# EAGLE schematic PC_adder (EAGLE 9.4.2)
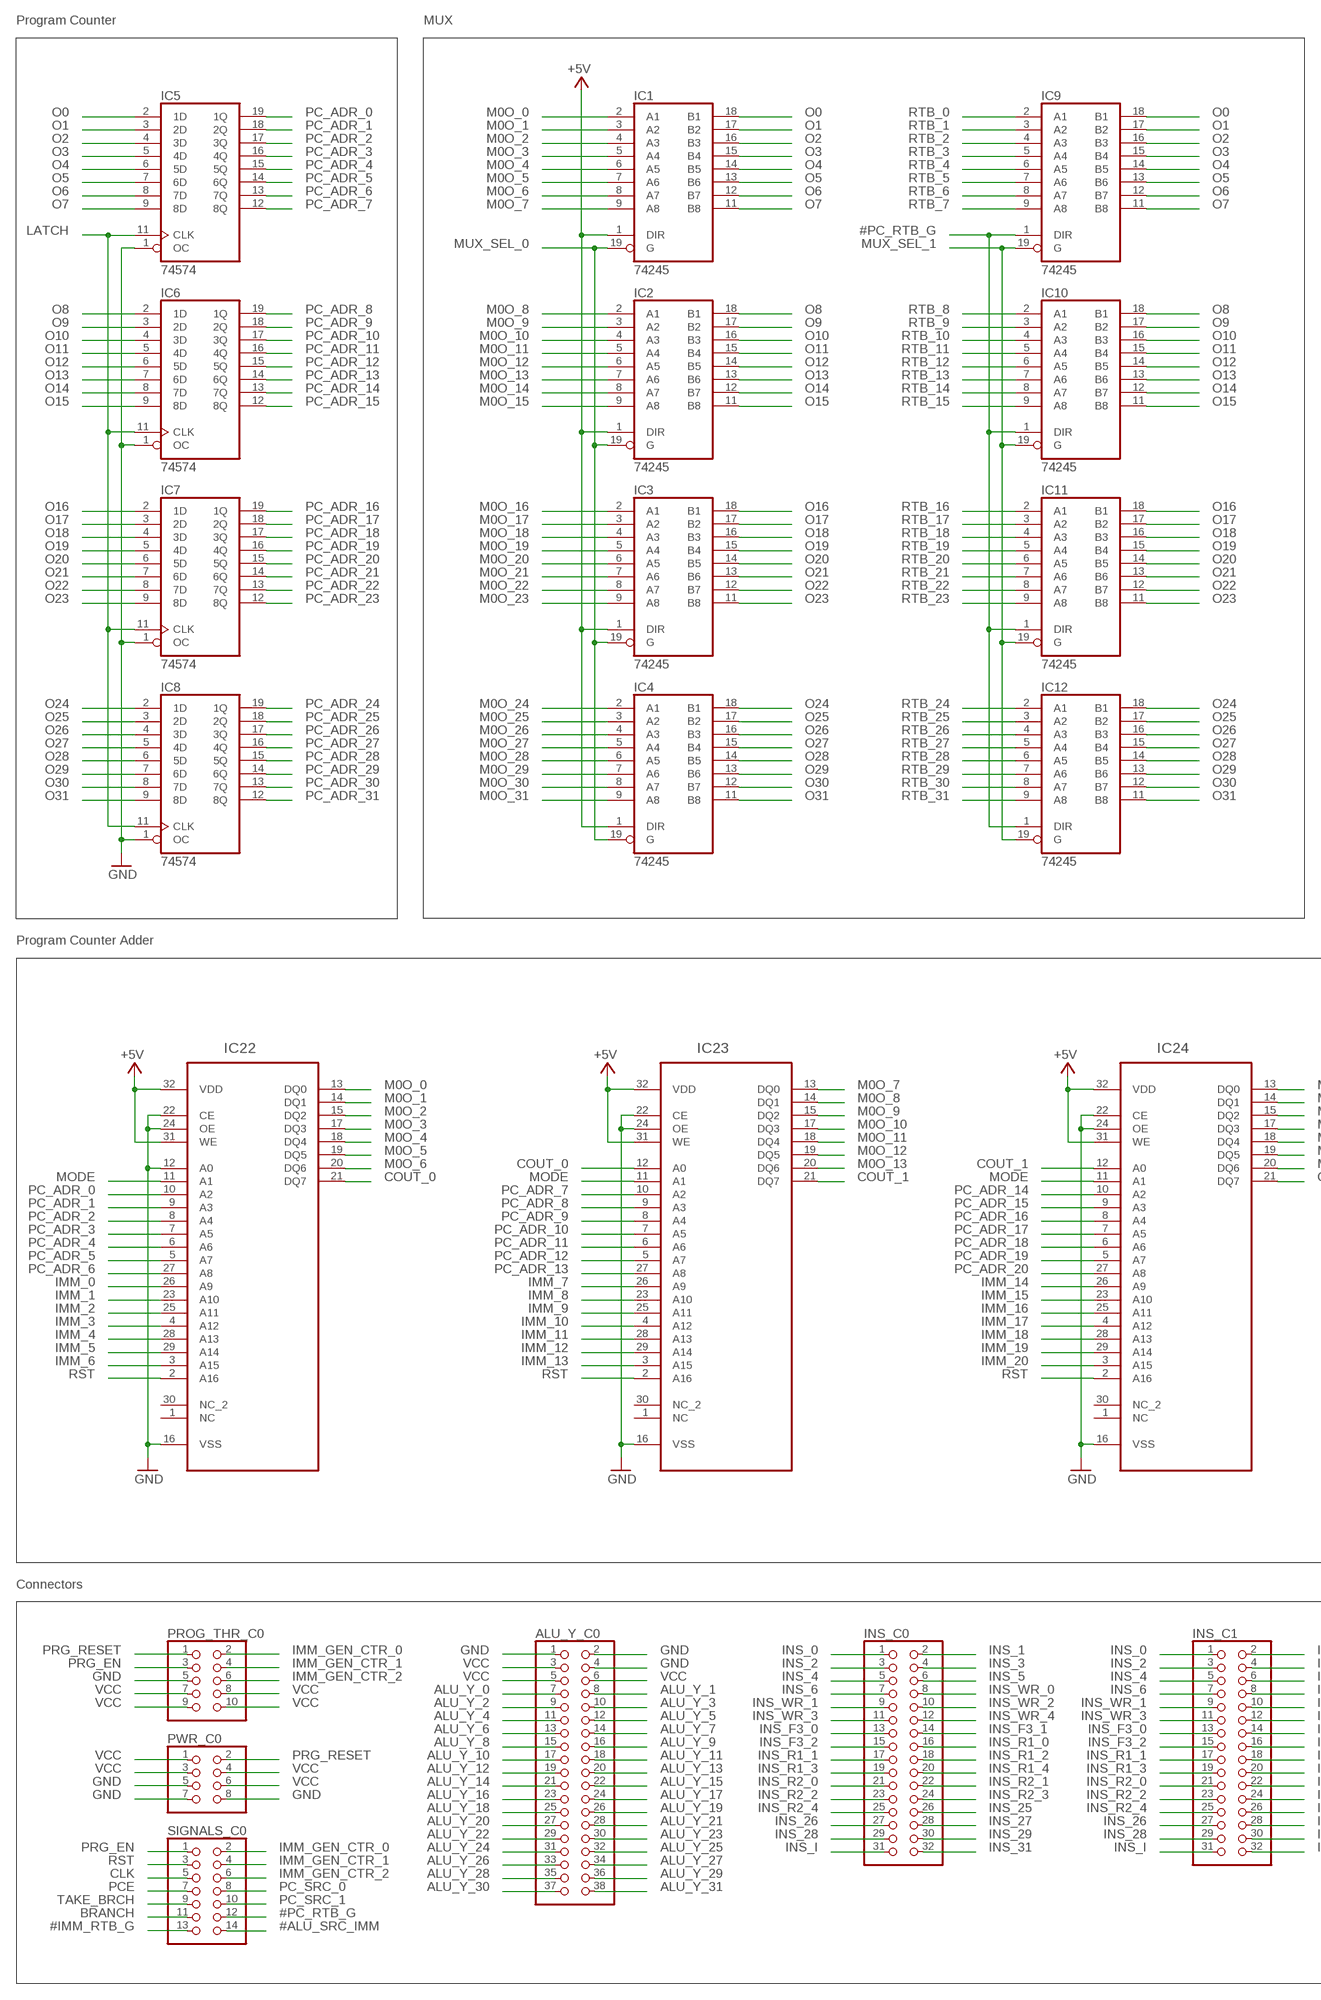
[diagram p0: schematic, sheet 1, part 1 of 2]
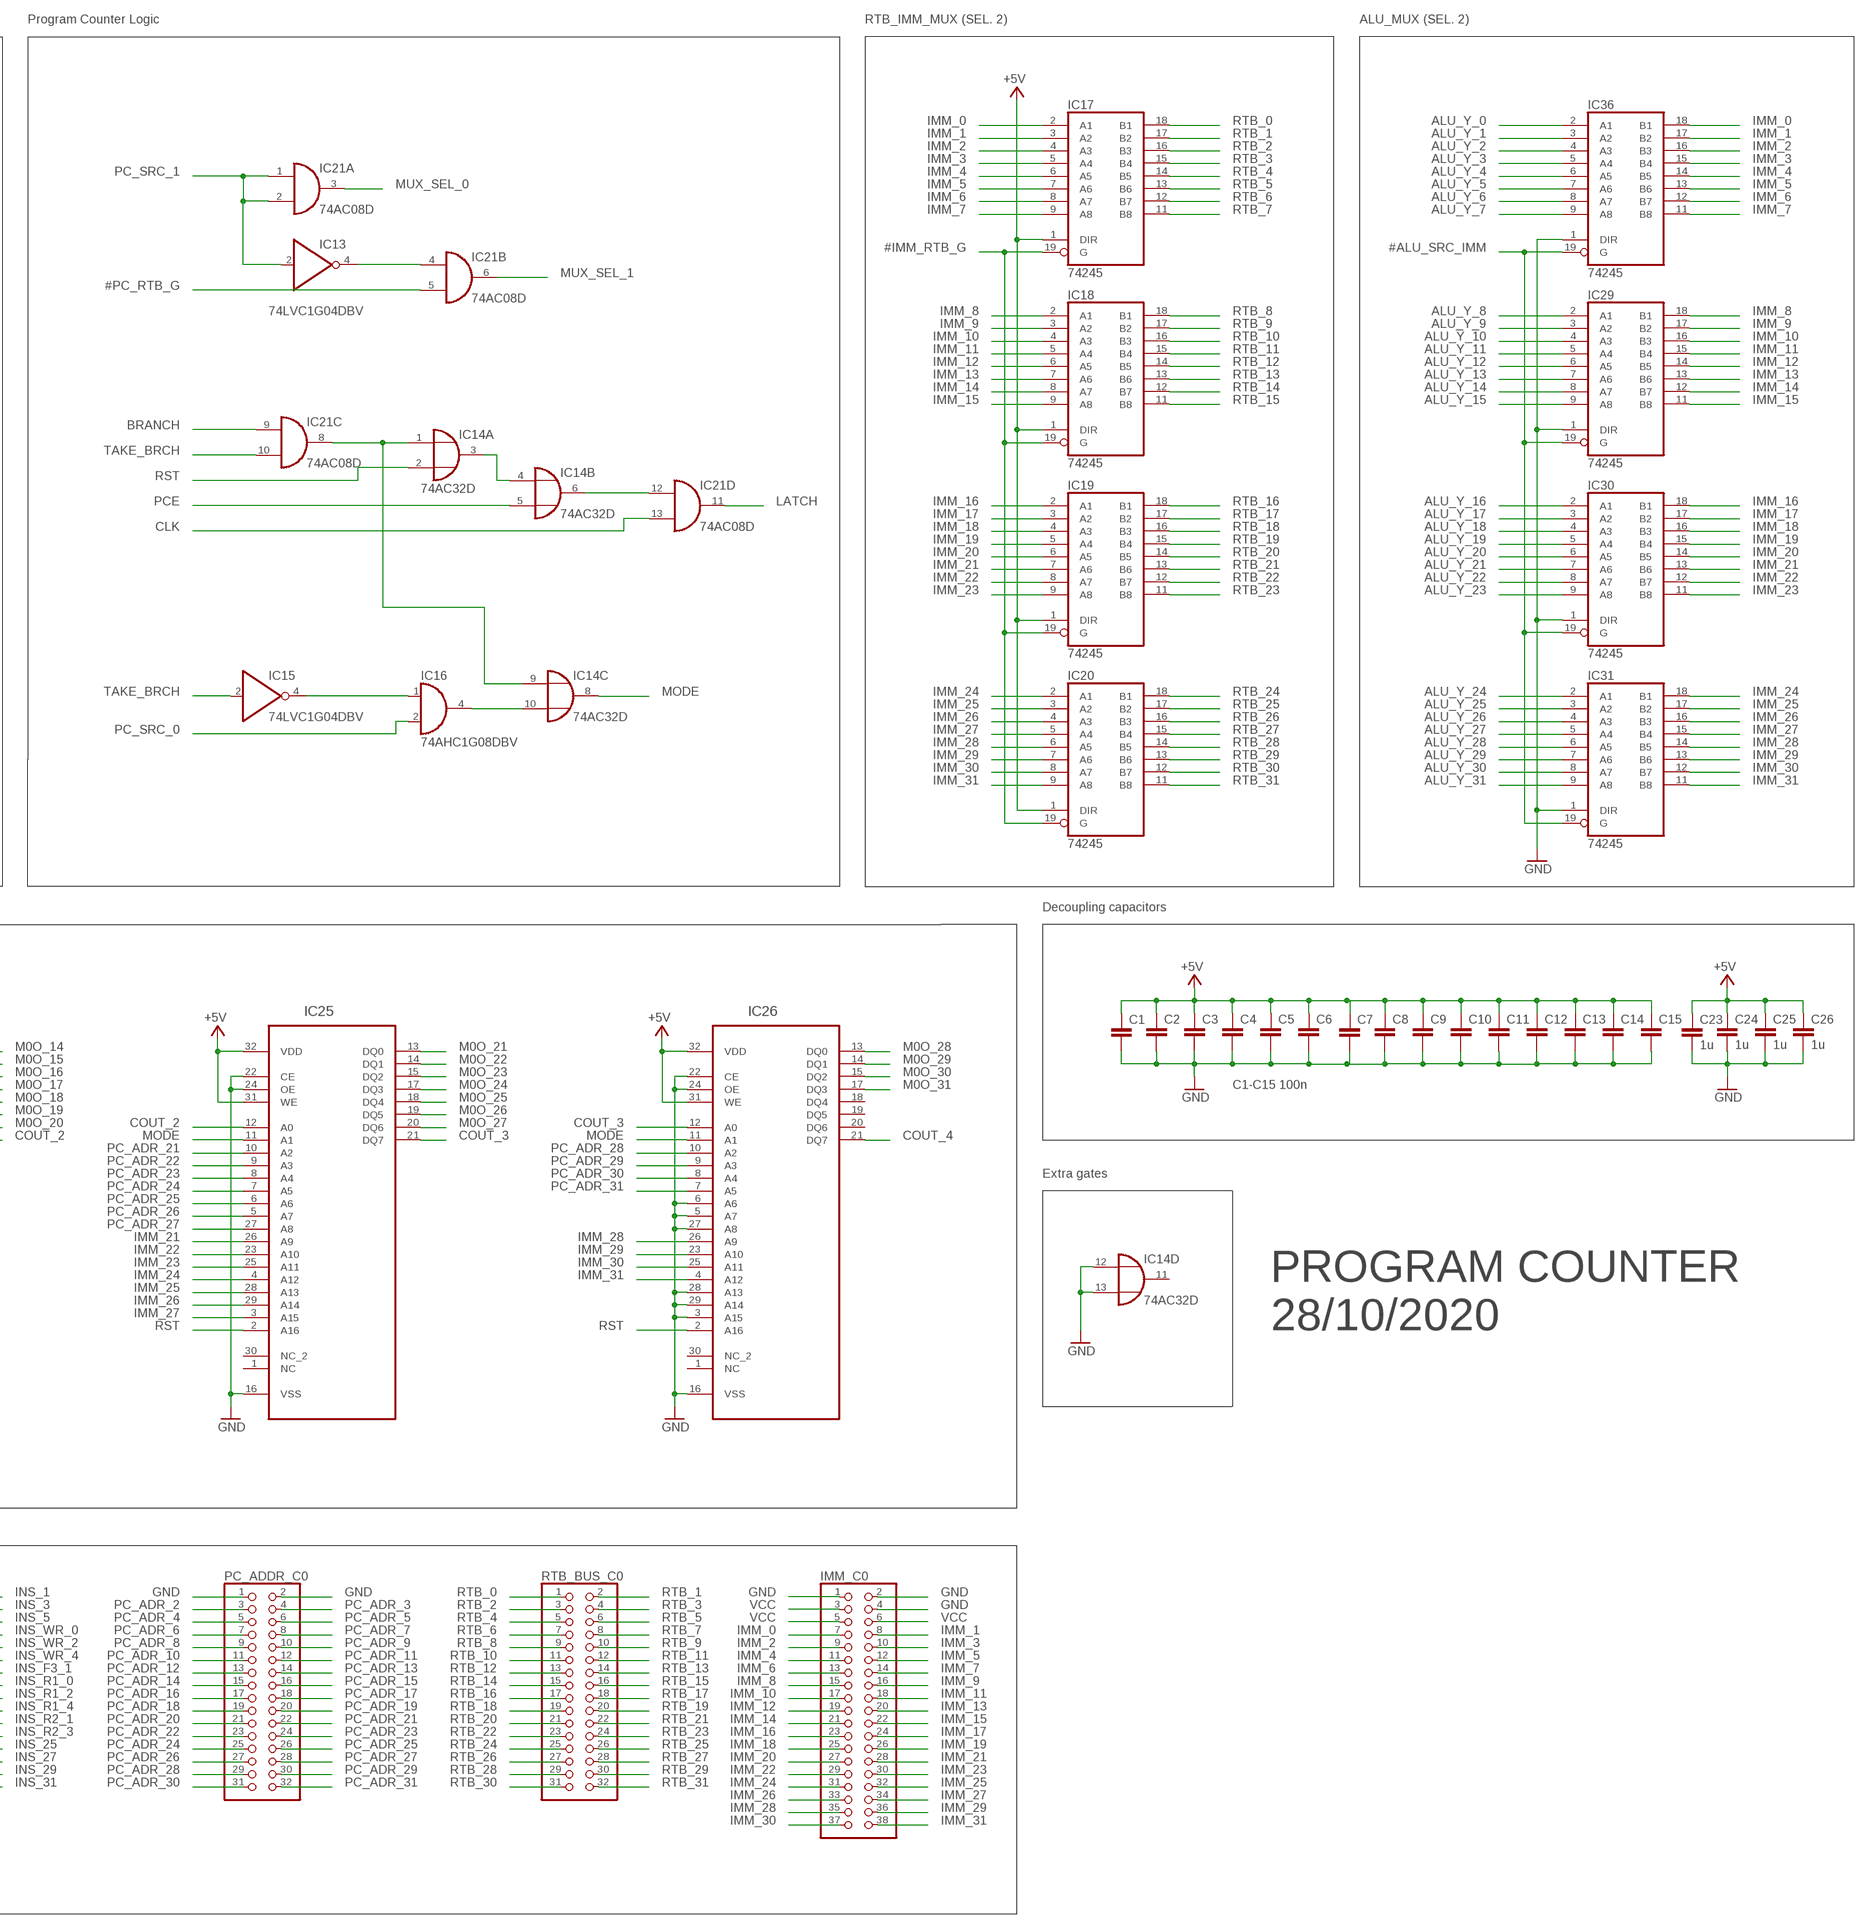
[diagram p1: schematic, sheet 1, part 2 of 2]

## Parts
ALU_Y_C0  PINHD-2X19  [2X19]
C1  C-EUC0805  [C0805]
C2  C-EUC0805  [C0805]
C3  C-EUC0805  [C0805]
C4  C-EUC0805  [C0805]
C5  C-EUC0805  [C0805]
C6  C-EUC0805  [C0805]
C7  C-EUC0805  [C0805]
C8  C-EUC0805  [C0805]
C9  C-EUC0805  [C0805]
C10  C-EUC0805  [C0805]
C11  C-EUC0805  [C0805]
C12  C-EUC0805  [C0805]
C13  C-EUC0805  [C0805]
C14  C-EUC0805  [C0805]
C15  C-EUC0805  [C0805]
C23  1u  C-EUC0805  [C0805]
C24  1u  C-EUC0805  [C0805]
C25  1u  C-EUC0805  [C0805]
C26  1u  C-EUC0805  [C0805]
IC1  74245  [TSSOP20]
IC2  74245  [TSSOP20]
IC3  74245  [TSSOP20]
IC4  74245  [TSSOP20]
IC5  74574  [TSSOP20]
IC6  74574  [TSSOP20]
IC7  74574  [TSSOP20]
IC8  74574  [TSSOP20]
IC9  74245  [TSSOP20]
IC10  74245  [TSSOP20]
IC11  74245  [TSSOP20]
IC12  74245  [TSSOP20]
IC13  74LVC1G04DBV  [SOT23-5]
IC14  74AC32D  [SO14]
IC15  74LVC1G04DBV  [SOT23-5]
IC16  74AHC1G08DBV  [SOT23-5]
IC17  74245  [TSSOP20]
IC18  74245  [TSSOP20]
IC19  74245  [TSSOP20]
IC20  74245  [TSSOP20]
IC21  74AC08D  [SO14]
IC22  SST39SF010A-70-4I-NHEPLCC32  [S32]
IC23  SST39SF010A-70-4I-NHEPLCC32  [S32]
IC24  SST39SF010A-70-4I-NHEPLCC32  [S32]
IC25  SST39SF010A-70-4I-NHEPLCC32  [S32]
IC26  SST39SF010A-70-4I-NHEPLCC32  [S32]
IC29  74245  [TSSOP20]
IC30  74245  [TSSOP20]
IC31  74245  [TSSOP20]
IC36  74245  [TSSOP20]
IMM_C0  PINHD-2X19  [2X19]
INS_C0  PINHD-2X16  [2X16]
INS_C1  PINHD-2X16  [2X16]
PC_ADDR_C0  PINHD-2X16  [2X16]
PROG_THR_C0  PINHD-2X5  [2X05]
PWR_C0  PINHD-2X4  [2X04]
RTB_BUS_C0  PINHD-2X16  [2X16]
SIGNALS_C0  PINHD-2X7  [2X07]

## Nets
#ALU_SRC_IMM: IC29.19(G) IC30.19(G) IC31.19(G) IC36.19(G) SIGNALS_C0.14
#IMM_RTB_G: IC17.19(G) IC18.19(G) IC19.19(G) IC20.19(G) SIGNALS_C0.13
#PC_RTB_G: IC9.1(DIR) IC10.1(DIR) IC11.1(DIR) IC12.1(DIR) IC21.5(B:I1) SIGNALS_C0.12
ALU_Y_0: ALU_Y_C0.7 IC36.2(A1)
ALU_Y_1: ALU_Y_C0.8 IC36.3(A2)
ALU_Y_2: ALU_Y_C0.9 IC36.4(A3)
ALU_Y_3: ALU_Y_C0.10 IC36.5(A4)
ALU_Y_4: ALU_Y_C0.11 IC36.6(A5)
ALU_Y_5: ALU_Y_C0.12 IC36.7(A6)
ALU_Y_6: ALU_Y_C0.13 IC36.8(A7)
ALU_Y_7: ALU_Y_C0.14 IC36.9(A8)
ALU_Y_8: ALU_Y_C0.15 IC29.2(A1)
ALU_Y_9: ALU_Y_C0.16 IC29.3(A2)
ALU_Y_10: ALU_Y_C0.17 IC29.4(A3)
ALU_Y_11: ALU_Y_C0.18 IC29.5(A4)
ALU_Y_12: ALU_Y_C0.19 IC29.6(A5)
ALU_Y_13: ALU_Y_C0.20 IC29.7(A6)
ALU_Y_14: ALU_Y_C0.21 IC29.8(A7)
ALU_Y_15: ALU_Y_C0.22 IC29.9(A8)
ALU_Y_16: ALU_Y_C0.23 IC30.2(A1)
ALU_Y_17: ALU_Y_C0.24 IC30.3(A2)
ALU_Y_18: ALU_Y_C0.25 IC30.4(A3)
ALU_Y_19: ALU_Y_C0.26 IC30.5(A4)
ALU_Y_20: ALU_Y_C0.27 IC30.6(A5)
ALU_Y_21: ALU_Y_C0.28 IC30.7(A6)
ALU_Y_22: ALU_Y_C0.29 IC30.8(A7)
ALU_Y_23: ALU_Y_C0.30 IC30.9(A8)
ALU_Y_24: ALU_Y_C0.31 IC31.2(A1)
ALU_Y_25: ALU_Y_C0.32 IC31.3(A2)
ALU_Y_26: ALU_Y_C0.33 IC31.4(A3)
ALU_Y_27: ALU_Y_C0.34 IC31.5(A4)
ALU_Y_28: ALU_Y_C0.35 IC31.6(A5)
ALU_Y_29: ALU_Y_C0.36 IC31.7(A6)
ALU_Y_30: ALU_Y_C0.37 IC31.8(A7)
ALU_Y_31: ALU_Y_C0.38 IC31.9(A8)
BRANCH: IC21.9(C:I0) SIGNALS_C0.11
BRANCH1: IC14.6(B:O) IC21.12(D:I0)
BRANCH2: IC15.4(O) IC16.1(I0)
BRCH&PC: IC14.10(C:I1) IC16.4(O)
CLK: IC21.13(D:I1) SIGNALS_C0.5
COUT_0: IC22.21(DQ7) IC23.12(A0)
COUT_1: IC23.21(DQ7) IC24.12(A0)
COUT_2: IC24.21(DQ7) IC25.12(A0)
COUT_3: IC25.21(DQ7) IC26.12(A0)
COUT_4: IC26.21(DQ7)
GND: ALU_Y_C0.1 ALU_Y_C0.2 ALU_Y_C0.4 C1.2 C2.2 C3.2 C4.2 C5.2 C6.2 C7.2 C8.2 C9.2 C10.2 C11.2 C12.2 C13.2 C14.2 C15.2 C23.2 C24.2 C25.2 C26.2 IC5.1(OC) IC6.1(OC) IC7.1(OC) IC8.1(OC) IC14.12(D:I0) IC14.13(D:I1) IC22.12(A0) IC22.16(VSS) IC22.22(CE) IC22.24(OE) IC23.16(VSS) IC23.22(CE) IC23.24(OE) IC24.16(VSS) IC24.22(CE) IC24.24(OE) IC25.16(VSS) IC25.22(CE) IC25.24(OE) IC26.3(A15) IC26.5(A7) IC26.6(A6) IC26.16(VSS) IC26.22(CE) IC26.24(OE) IC26.27(A8) IC26.28(A13) IC26.29(A14) IC29.1(DIR) IC30.1(DIR) IC31.1(DIR) IC36.1(DIR) IMM_C0.1 IMM_C0.2 IMM_C0.4 PC_ADDR_C0.1 PC_ADDR_C0.2 PROG_THR_C0.5 PWR_C0.5 PWR_C0.7 PWR_C0.8
IMM_0: IC17.2(A1) IC22.26(A9) IC36.18(B1) IMM_C0.7
IMM_1: IC17.3(A2) IC22.23(A10) IC36.17(B2) IMM_C0.8
IMM_2: IC17.4(A3) IC22.25(A11) IC36.16(B3) IMM_C0.9
IMM_3: IC17.5(A4) IC22.4(A12) IC36.15(B4) IMM_C0.10
IMM_4: IC17.6(A5) IC22.28(A13) IC36.14(B5) IMM_C0.11
IMM_5: IC17.7(A6) IC22.29(A14) IC36.13(B6) IMM_C0.12
IMM_6: IC17.8(A7) IC22.3(A15) IC36.12(B7) IMM_C0.13
IMM_7: IC17.9(A8) IC23.26(A9) IC36.11(B8) IMM_C0.14
IMM_8: IC18.2(A1) IC23.23(A10) IC29.18(B1) IMM_C0.15
IMM_9: IC18.3(A2) IC23.25(A11) IC29.17(B2) IMM_C0.16
IMM_10: IC18.4(A3) IC23.4(A12) IC29.16(B3) IMM_C0.17
IMM_11: IC18.5(A4) IC23.28(A13) IC29.15(B4) IMM_C0.18
IMM_12: IC18.6(A5) IC23.29(A14) IC29.14(B5) IMM_C0.19
IMM_13: IC18.7(A6) IC23.3(A15) IC29.13(B6) IMM_C0.20
IMM_14: IC18.8(A7) IC24.26(A9) IC29.12(B7) IMM_C0.21
IMM_15: IC18.9(A8) IC24.23(A10) IC29.11(B8) IMM_C0.22
IMM_16: IC19.2(A1) IC24.25(A11) IC30.18(B1) IMM_C0.23
IMM_17: IC19.3(A2) IC24.4(A12) IC30.17(B2) IMM_C0.24
IMM_18: IC19.4(A3) IC24.28(A13) IC30.16(B3) IMM_C0.25
IMM_19: IC19.5(A4) IC24.29(A14) IC30.15(B4) IMM_C0.26
IMM_20: IC19.6(A5) IC24.3(A15) IC30.14(B5) IMM_C0.27
IMM_21: IC19.7(A6) IC25.26(A9) IC30.13(B6) IMM_C0.28
IMM_22: IC19.8(A7) IC25.23(A10) IC30.12(B7) IMM_C0.29
IMM_23: IC19.9(A8) IC25.25(A11) IC30.11(B8) IMM_C0.30
IMM_24: IC20.2(A1) IC25.4(A12) IC31.18(B1) IMM_C0.31
IMM_25: IC20.3(A2) IC25.28(A13) IC31.17(B2) IMM_C0.32
IMM_26: IC20.4(A3) IC25.29(A14) IC31.16(B3) IMM_C0.33
IMM_27: IC20.5(A4) IC25.3(A15) IC31.15(B4) IMM_C0.34
IMM_28: IC20.6(A5) IC26.26(A9) IC31.14(B5) IMM_C0.35
IMM_29: IC20.7(A6) IC26.23(A10) IC31.13(B6) IMM_C0.36
IMM_30: IC20.8(A7) IC26.25(A11) IC31.12(B7) IMM_C0.37
IMM_31: IC20.9(A8) IC26.4(A12) IC31.11(B8) IMM_C0.38
IMM_GEN_CTR_0: PROG_THR_C0.2 SIGNALS_C0.2
IMM_GEN_CTR_1: PROG_THR_C0.4 SIGNALS_C0.4
IMM_GEN_CTR_2: PROG_THR_C0.6 SIGNALS_C0.6
INS_0: INS_C0.1 INS_C1.1
INS_1: INS_C0.2 INS_C1.2
INS_2: INS_C0.3 INS_C1.3
INS_3: INS_C0.4 INS_C1.4
INS_4: INS_C0.5 INS_C1.5
INS_5: INS_C0.6 INS_C1.6
INS_6: INS_C0.7 INS_C1.7
INS_25: INS_C0.26 INS_C1.26
INS_26: INS_C0.27 INS_C1.27
INS_27: INS_C0.28 INS_C1.28
INS_28: INS_C0.29 INS_C1.29
INS_29: INS_C0.30 INS_C1.30
INS_31: INS_C0.32 INS_C1.32
INS_F3_0: INS_C0.13 INS_C1.13
INS_F3_1: INS_C0.14 INS_C1.14
INS_F3_2: INS_C0.15 INS_C1.15
INS_I: INS_C0.31 INS_C1.31
INS_R1_0: INS_C0.16 INS_C1.16
INS_R1_1: INS_C0.17 INS_C1.17
INS_R1_2: INS_C0.18 INS_C1.18
INS_R1_3: INS_C0.19 INS_C1.19
INS_R1_4: INS_C0.20 INS_C1.20
INS_R2_0: INS_C0.21 INS_C1.21
INS_R2_1: INS_C0.22 INS_C1.22
INS_R2_2: INS_C0.23 INS_C1.23
INS_R2_3: INS_C0.24 INS_C1.24
INS_R2_4: INS_C0.25 INS_C1.25
INS_WR_0: INS_C0.8 INS_C1.8
INS_WR_1: INS_C0.9 INS_C1.9
INS_WR_2: INS_C0.10 INS_C1.10
INS_WR_3: INS_C0.11 INS_C1.11
INS_WR_4: INS_C0.12 INS_C1.12
LATCH: IC5.11(CLK) IC6.11(CLK) IC7.11(CLK) IC8.11(CLK) IC21.11(D:O)
M0O_0: IC1.2(A1) IC22.13(DQ0)
M0O_1: IC1.3(A2) IC22.14(DQ1)
M0O_2: IC1.4(A3) IC22.15(DQ2)
M0O_3: IC1.5(A4) IC22.17(DQ3)
M0O_4: IC1.6(A5) IC22.18(DQ4)
M0O_5: IC1.7(A6) IC22.19(DQ5)
M0O_6: IC1.8(A7) IC22.20(DQ6)
M0O_7: IC1.9(A8) IC23.13(DQ0)
M0O_8: IC2.2(A1) IC23.14(DQ1)
M0O_9: IC2.3(A2) IC23.15(DQ2)
M0O_10: IC2.4(A3) IC23.17(DQ3)
M0O_11: IC2.5(A4) IC23.18(DQ4)
M0O_12: IC2.6(A5) IC23.19(DQ5)
M0O_13: IC2.7(A6) IC23.20(DQ6)
M0O_14: IC2.8(A7) IC24.13(DQ0)
M0O_15: IC2.9(A8) IC24.14(DQ1)
M0O_16: IC3.2(A1) IC24.15(DQ2)
M0O_17: IC3.3(A2) IC24.17(DQ3)
M0O_18: IC3.4(A3) IC24.18(DQ4)
M0O_19: IC3.5(A4) IC24.19(DQ5)
M0O_20: IC3.6(A5) IC24.20(DQ6)
M0O_21: IC3.7(A6) IC25.13(DQ0)
M0O_22: IC3.8(A7) IC25.14(DQ1)
M0O_23: IC3.9(A8) IC25.15(DQ2)
M0O_24: IC4.2(A1) IC25.17(DQ3)
M0O_25: IC4.3(A2) IC25.18(DQ4)
M0O_26: IC4.4(A3) IC25.19(DQ5)
M0O_27: IC4.5(A4) IC25.20(DQ6)
M0O_28: IC4.6(A5) IC26.13(DQ0)
M0O_29: IC4.7(A6) IC26.14(DQ1)
M0O_30: IC4.8(A7) IC26.15(DQ2)
M0O_31: IC4.9(A8) IC26.17(DQ3)
MODE: IC14.8(C:O) IC22.11(A1) IC23.11(A1) IC24.11(A1) IC25.11(A1) IC26.11(A1)
MUX_SEL_0: IC1.19(G) IC2.19(G) IC3.19(G) IC4.19(G) IC21.3(A:O)
MUX_SEL_1: IC9.19(G) IC10.19(G) IC11.19(G) IC12.19(G) IC21.6(B:O)
N$1: IC13.4(O) IC21.4(B:I0)
N$2: IC14.1(A:I0) IC14.9(C:I0) IC21.8(C:O)
N$4: IC14.3(A:O) IC14.4(B:I0)
O0: IC1.18(B1) IC5.2(1D) IC9.18(B1)
O1: IC1.17(B2) IC5.3(2D) IC9.17(B2)
O2: IC1.16(B3) IC5.4(3D) IC9.16(B3)
O3: IC1.15(B4) IC5.5(4D) IC9.15(B4)
O4: IC1.14(B5) IC5.6(5D) IC9.14(B5)
O5: IC1.13(B6) IC5.7(6D) IC9.13(B6)
O6: IC1.12(B7) IC5.8(7D) IC9.12(B7)
O7: IC1.11(B8) IC5.9(8D) IC9.11(B8)
O8: IC2.18(B1) IC6.2(1D) IC10.18(B1)
O9: IC2.17(B2) IC6.3(2D) IC10.17(B2)
O10: IC2.16(B3) IC6.4(3D) IC10.16(B3)
O11: IC2.15(B4) IC6.5(4D) IC10.15(B4)
O12: IC2.14(B5) IC6.6(5D) IC10.14(B5)
O13: IC2.13(B6) IC6.7(6D) IC10.13(B6)
O14: IC2.12(B7) IC6.8(7D) IC10.12(B7)
O15: IC2.11(B8) IC6.9(8D) IC10.11(B8)
O16: IC3.18(B1) IC7.2(1D) IC11.18(B1)
O17: IC3.17(B2) IC7.3(2D) IC11.17(B2)
O18: IC3.16(B3) IC7.4(3D) IC11.16(B3)
O19: IC3.15(B4) IC7.5(4D) IC11.15(B4)
O20: IC3.14(B5) IC7.6(5D) IC11.14(B5)
O21: IC3.13(B6) IC7.7(6D) IC11.13(B6)
O22: IC3.12(B7) IC7.8(7D) IC11.12(B7)
O23: IC3.11(B8) IC7.9(8D) IC11.11(B8)
O24: IC4.18(B1) IC8.2(1D) IC12.18(B1)
O25: IC4.17(B2) IC8.3(2D) IC12.17(B2)
O26: IC4.16(B3) IC8.4(3D) IC12.16(B3)
O27: IC4.15(B4) IC8.5(4D) IC12.15(B4)
O28: IC4.14(B5) IC8.6(5D) IC12.14(B5)
O29: IC4.13(B6) IC8.7(6D) IC12.13(B6)
O30: IC4.12(B7) IC8.8(7D) IC12.12(B7)
O31: IC4.11(B8) IC8.9(8D) IC12.11(B8)
PC_ADR_0: IC5.19(1Q) IC22.10(A2)
PC_ADR_1: IC5.18(2Q) IC22.9(A3)
PC_ADR_2: IC5.17(3Q) IC22.8(A4) PC_ADDR_C0.3
PC_ADR_3: IC5.16(4Q) IC22.7(A5) PC_ADDR_C0.4
PC_ADR_4: IC5.15(5Q) IC22.6(A6) PC_ADDR_C0.5
PC_ADR_5: IC5.14(6Q) IC22.5(A7) PC_ADDR_C0.6
PC_ADR_6: IC5.13(7Q) IC22.27(A8) PC_ADDR_C0.7
PC_ADR_7: IC5.12(8Q) IC23.10(A2) PC_ADDR_C0.8
PC_ADR_8: IC6.19(1Q) IC23.9(A3) PC_ADDR_C0.9
PC_ADR_9: IC6.18(2Q) IC23.8(A4) PC_ADDR_C0.10
PC_ADR_10: IC6.17(3Q) IC23.7(A5) PC_ADDR_C0.11
PC_ADR_11: IC6.16(4Q) IC23.6(A6) PC_ADDR_C0.12
PC_ADR_12: IC6.15(5Q) IC23.5(A7) PC_ADDR_C0.13
PC_ADR_13: IC6.14(6Q) IC23.27(A8) PC_ADDR_C0.14
PC_ADR_14: IC6.13(7Q) IC24.10(A2) PC_ADDR_C0.15
PC_ADR_15: IC6.12(8Q) IC24.9(A3) PC_ADDR_C0.16
PC_ADR_16: IC7.19(1Q) IC24.8(A4) PC_ADDR_C0.17
PC_ADR_17: IC7.18(2Q) IC24.7(A5) PC_ADDR_C0.18
PC_ADR_18: IC7.17(3Q) IC24.6(A6) PC_ADDR_C0.19
PC_ADR_19: IC7.16(4Q) IC24.5(A7) PC_ADDR_C0.20
PC_ADR_20: IC7.15(5Q) IC24.27(A8) PC_ADDR_C0.21
PC_ADR_21: IC7.14(6Q) IC25.10(A2) PC_ADDR_C0.22
PC_ADR_22: IC7.13(7Q) IC25.9(A3) PC_ADDR_C0.23
PC_ADR_23: IC7.12(8Q) IC25.8(A4) PC_ADDR_C0.24
PC_ADR_24: IC8.19(1Q) IC25.7(A5) PC_ADDR_C0.25
PC_ADR_25: IC8.18(2Q) IC25.6(A6) PC_ADDR_C0.26
PC_ADR_26: IC8.17(3Q) IC25.5(A7) PC_ADDR_C0.27
PC_ADR_27: IC8.16(4Q) IC25.27(A8) PC_ADDR_C0.28
PC_ADR_28: IC8.15(5Q) IC26.10(A2) PC_ADDR_C0.29
PC_ADR_29: IC8.14(6Q) IC26.9(A3) PC_ADDR_C0.30
PC_ADR_30: IC8.13(7Q) IC26.8(A4) PC_ADDR_C0.31
PC_ADR_31: IC8.12(8Q) IC26.7(A5) PC_ADDR_C0.32
PC_SRC_0: IC16.2(I1) SIGNALS_C0.8
PC_SRC_1: IC13.2(I) IC21.1(A:I0) IC21.2(A:I1) SIGNALS_C0.10
PCE: IC14.5(B:I1) SIGNALS_C0.7
PRG_EN: PROG_THR_C0.3 SIGNALS_C0.1
PRG_RESET: PROG_THR_C0.1 PWR_C0.2
RST: IC14.2(A:I1) IC22.2(A16) IC23.2(A16) IC24.2(A16) IC25.2(A16) IC26.2(A16) SIGNALS_C0.3
RTB_0: IC9.2(A1) IC17.18(B1) RTB_BUS_C0.1
RTB_1: IC9.3(A2) IC17.17(B2) RTB_BUS_C0.2
RTB_2: IC9.4(A3) IC17.16(B3) RTB_BUS_C0.3
RTB_3: IC9.5(A4) IC17.15(B4) RTB_BUS_C0.4
RTB_4: IC9.6(A5) IC17.14(B5) RTB_BUS_C0.5
RTB_5: IC9.7(A6) IC17.13(B6) RTB_BUS_C0.6
RTB_6: IC9.8(A7) IC17.12(B7) RTB_BUS_C0.7
RTB_7: IC9.9(A8) IC17.11(B8) RTB_BUS_C0.8
RTB_8: IC10.2(A1) IC18.18(B1) RTB_BUS_C0.9
RTB_9: IC10.3(A2) IC18.17(B2) RTB_BUS_C0.10
RTB_10: IC10.4(A3) IC18.16(B3) RTB_BUS_C0.11
RTB_11: IC10.5(A4) IC18.15(B4) RTB_BUS_C0.12
RTB_12: IC10.6(A5) IC18.14(B5) RTB_BUS_C0.13
RTB_13: IC10.7(A6) IC18.13(B6) RTB_BUS_C0.14
RTB_14: IC10.8(A7) IC18.12(B7) RTB_BUS_C0.15
RTB_15: IC10.9(A8) IC18.11(B8) RTB_BUS_C0.16
RTB_16: IC11.2(A1) IC19.18(B1) RTB_BUS_C0.17
RTB_17: IC11.3(A2) IC19.17(B2) RTB_BUS_C0.18
RTB_18: IC11.4(A3) IC19.16(B3) RTB_BUS_C0.19
RTB_19: IC11.5(A4) IC19.15(B4) RTB_BUS_C0.20
RTB_20: IC11.6(A5) IC19.14(B5) RTB_BUS_C0.21
RTB_21: IC11.7(A6) IC19.13(B6) RTB_BUS_C0.22
RTB_22: IC11.8(A7) IC19.12(B7) RTB_BUS_C0.23
RTB_23: IC11.9(A8) IC19.11(B8) RTB_BUS_C0.24
RTB_24: IC12.2(A1) IC20.18(B1) RTB_BUS_C0.25
RTB_25: IC12.3(A2) IC20.17(B2) RTB_BUS_C0.26
RTB_26: IC12.4(A3) IC20.16(B3) RTB_BUS_C0.27
RTB_27: IC12.5(A4) IC20.15(B4) RTB_BUS_C0.28
RTB_28: IC12.6(A5) IC20.14(B5) RTB_BUS_C0.29
RTB_29: IC12.7(A6) IC20.13(B6) RTB_BUS_C0.30
RTB_30: IC12.8(A7) IC20.12(B7) RTB_BUS_C0.31
RTB_31: IC12.9(A8) IC20.11(B8) RTB_BUS_C0.32
TAKE_BRCH: IC15.2(I) IC21.10(C:I1) SIGNALS_C0.9
VCC: ALU_Y_C0.3 ALU_Y_C0.5 ALU_Y_C0.6 C1.1 C2.1 C3.1 C4.1 C5.1 C6.1 C7.1 C8.1 C9.1 C10.1 C11.1 C12.1 C13.1 C14.1 C15.1 C23.1 C24.1 C25.1 C26.1 IC1.1(DIR) IC2.1(DIR) IC3.1(DIR) IC4.1(DIR) IC17.1(DIR) IC18.1(DIR) IC19.1(DIR) IC20.1(DIR) IC22.31(WE) IC22.32(VDD) IC23.31(WE) IC23.32(VDD) IC24.31(WE) IC24.32(VDD) IC25.31(WE) IC25.32(VDD) IC26.31(WE) IC26.32(VDD) IMM_C0.3 IMM_C0.5 IMM_C0.6 PROG_THR_C0.7 PROG_THR_C0.8 PROG_THR_C0.9 PROG_THR_C0.10 PWR_C0.1 PWR_C0.3 PWR_C0.4 PWR_C0.6 ; supply symbol labelled +5V
Unconnected: IC14.11(D:O) IC22.1(NC) IC22.30(NC_2) IC23.1(NC) IC23.30(NC_2) IC24.1(NC) IC24.30(NC_2) IC25.1(NC) IC25.30(NC_2) IC26.1(NC) IC26.18(DQ4) IC26.19(DQ5) IC26.20(DQ6) IC26.30(NC_2)

## Notes on the sheet
- Program Counter | MUX | Program Counter Logic | RTB_IMM_MUX (SEL. 2) | ALU_MUX (SEL. 2)
- Program Counter Adder | Decoupling capacitors
- C1-C15 100n
- Extra gates
- PROGRAM COUNTER
  28/10/2020
- Connectors

## Power pins joined to a net without a drawn wire
GND: IC1.10(GND) IC2.10(GND) IC3.10(GND) IC4.10(GND) IC5.10(GND) IC6.10(GND) IC7.10(GND) IC8.10(GND) IC9.10(GND) IC10.10(GND) IC11.10(GND) IC12.10(GND) IC13.3(GND) IC14.7(P:GND) IC15.3(GND) IC16.3(GND) IC17.10(GND) IC18.10(GND) IC19.10(GND) IC20.10(GND) IC21.7(P:GND) IC29.10(GND) IC30.10(GND) IC31.10(GND) IC36.10(GND)
VCC: IC1.20(VCC) IC2.20(VCC) IC3.20(VCC) IC4.20(VCC) IC5.20(VCC) IC6.20(VCC) IC7.20(VCC) IC8.20(VCC) IC9.20(VCC) IC10.20(VCC) IC11.20(VCC) IC12.20(VCC) IC13.5(VCC) IC14.14(P:VCC) IC15.5(VCC) IC16.5(VCC) IC17.20(VCC) IC18.20(VCC) IC19.20(VCC) IC20.20(VCC) IC21.14(P:VCC) IC29.20(VCC) IC30.20(VCC) IC31.20(VCC) IC36.20(VCC)

## Library data of the parts
ALU_Y_C0 = pinhead:PINHD-2X19: PIN HEADER
C1-C15 C23-C26 = rcl:C-EU: CAPACITOR, European symbol; SPICEPREFIX: C
IC1-IC4 IC9-IC12 IC17-IC20 IC29-IC31 IC36 = AAA__74xx-eu:74*245: Octal BUS TRANSCEIVER, 3-state
IC5-IC8 = AAA__74xx-eu:74*574: 8-bit D type FLIP FLOP bus driver
IC13 IC15 = 74xx-little-de:74*1G04: INVERTER Gate
IC14 = AAA__74xx-eu:74*32: Quad 2-input OR gate
IC16 = 74xx-little-de:74*1G08: 2-input AND gate
IC21 = AAA__74xx-eu:74*08: Quad 2-input AND gate
IC22-IC26 = SST39SF010A-70-4I-NHE:SST39SF010A-70-4I-NHE: 1MB Flash
IMM_C0 = pinhead_bottom:PINHD-2X19: PIN HEADER
INS_C0 PC_ADDR_C0 = pinhead_bottom:PINHD-2X16: PIN HEADER
INS_C1 RTB_BUS_C0 = pinhead:PINHD-2X16: PIN HEADER
PROG_THR_C0 = pinhead_bottom:PINHD-2X5: PIN HEADER
PWR_C0 = pinhead:PINHD-2X4: PIN HEADER
SIGNALS_C0 = Connector:PINHD-2X7: PIN HEADER; CATEGORY: CONNECTOR; SUB-CATEGORY: PIN-HEADER